# Altium project GRIPPER2009.PrjPcb (part 2 of 2)
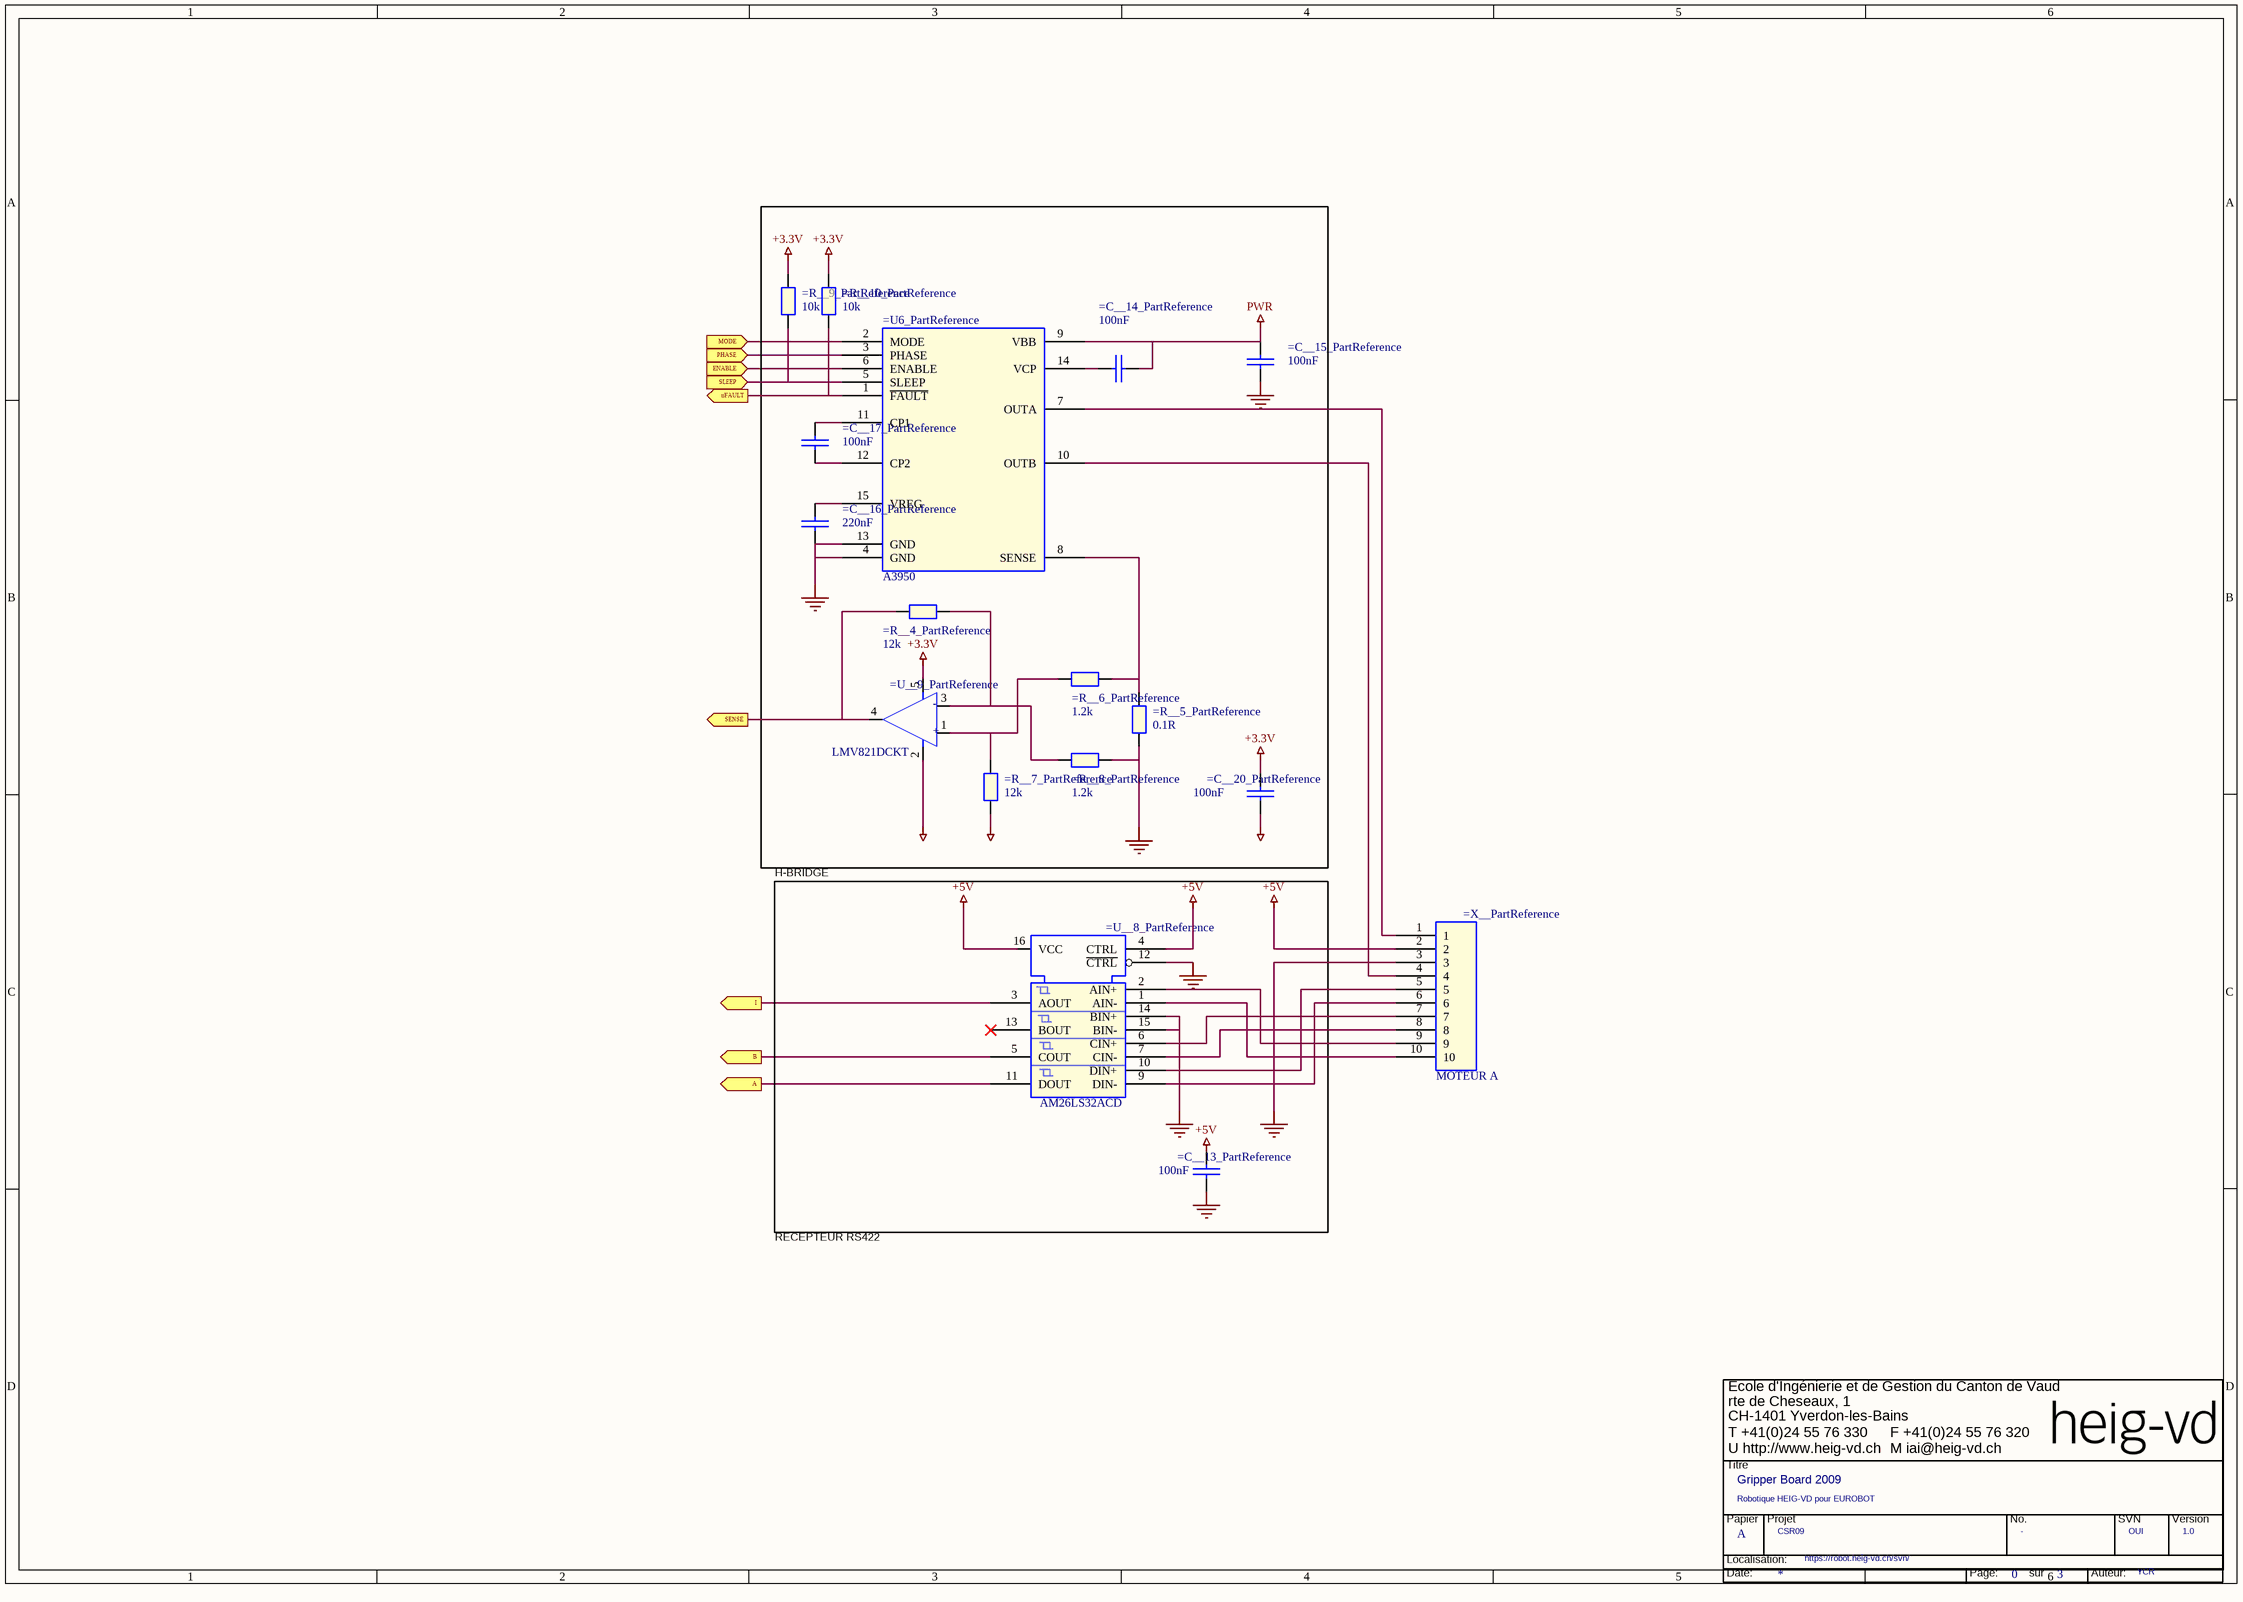
[diagram p7: 4.SchDoc]

## Nets that join several sheets
+1.8V: 2 (C10.1 C11.1 L5.2 R6.2), TWO MOTORS (14 pins), TWO MOTORS1 (14 pins)
+3.3V: 2 (C5.1 IC1.4 L3.2 R2.2), 3 (13 pins), TWO MOTORS (25 pins), TWO MOTORS/DRIVE1 (=C__20_PartReference_TWO_MOTORS_DRIVE1.1 =R__9_PartReference_TWO_MOTORS_DRIVE1.2 =R__10_PartReference_TWO_MOTORS_DRIVE1.2 =U__9_PartReference_TWO_MOTORS_DRIVE1.5), TWO MOTORS/DRIVE (=C__20_PartReference_TWO_MOTORS_DRIVE.1 =R__9_PartReference_TWO_MOTORS_DRIVE.2 =R__10_PartReference_TWO_MOTORS_DRIVE.2 =U__9_PartReference_TWO_MOTORS_DRIVE.5), TWO MOTORS1 (25 pins), TWO MOTORS1/DRIVE1 (=C__20_PartReference_TWO_MOTORS1_DRIVE1.1 =R__9_PartReference_TWO_MOTORS1_DRIVE1.2 =R__10_PartReference_TWO_MOTORS1_DRIVE1.2 =U__9_PartReference_TWO_MOTORS1_DRIVE1.5), TWO MOTORS1/DRIVE (=C__20_PartReference_TWO_MOTORS1_DRIVE.1 =R__9_PartReference_TWO_MOTORS1_DRIVE.2 =R__10_PartReference_TWO_MOTORS1_DRIVE.2 =U__9_PartReference_TWO_MOTORS1_DRIVE.5)
+5V: 2 (7 pins), 3 (7 pins), TWO MOTORS (=X29_PartReference_TWO_MOTORS.1 =X29_PartReference_TWO_MOTORS.2), TWO MOTORS/DRIVE1 (=C__13_PartReference_TWO_MOTORS_DRIVE1.1 =U__8_PartReference_TWO_MOTORS_DRIVE1.4 =U__8_PartReference_TWO_MOTORS_DRIVE1.16 =X__PartReference_TWO_MOTORS_DRIVE1.2), TWO MOTORS/DRIVE (=C__13_PartReference_TWO_MOTORS_DRIVE.1 =U__8_PartReference_TWO_MOTORS_DRIVE.4 =U__8_PartReference_TWO_MOTORS_DRIVE.16 =X__PartReference_TWO_MOTORS_DRIVE.2), TWO MOTORS1 (=X29_PartReference_TWO_MOTORS1.1 =X29_PartReference_TWO_MOTORS1.2), TWO MOTORS1/DRIVE1 (=C__13_PartReference_TWO_MOTORS1_DRIVE1.1 =U__8_PartReference_TWO_MOTORS1_DRIVE1.4 =U__8_PartReference_TWO_MOTORS1_DRIVE1.16 =X__PartReference_TWO_MOTORS1_DRIVE1.2), TWO MOTORS1/DRIVE (=C__13_PartReference_TWO_MOTORS1_DRIVE.1 =U__8_PartReference_TWO_MOTORS1_DRIVE.4 =U__8_PartReference_TWO_MOTORS1_DRIVE.16 =X__PartReference_TWO_MOTORS1_DRIVE.2)
+12V: 2 (L2.2), 3 (9 pins)
AGND: 2 (R150.2), TWO MOTORS (16 pins), TWO MOTORS/DRIVE1 (=C__20_PartReference_TWO_MOTORS_DRIVE1.2 =R__7_PartReference_TWO_MOTORS_DRIVE1.1 =U__9_PartReference_TWO_MOTORS_DRIVE1.2), TWO MOTORS/DRIVE (=C__20_PartReference_TWO_MOTORS_DRIVE.2 =R__7_PartReference_TWO_MOTORS_DRIVE.1 =U__9_PartReference_TWO_MOTORS_DRIVE.2), TWO MOTORS1 (16 pins), TWO MOTORS1/DRIVE1 (=C__20_PartReference_TWO_MOTORS1_DRIVE1.2 =R__7_PartReference_TWO_MOTORS1_DRIVE1.1 =U__9_PartReference_TWO_MOTORS1_DRIVE1.2), TWO MOTORS1/DRIVE (=C__20_PartReference_TWO_MOTORS1_DRIVE.2 =R__7_PartReference_TWO_MOTORS1_DRIVE.1 =U__9_PartReference_TWO_MOTORS1_DRIVE.2)
GND: 2 (20 pins), 3 (35 pins), TWO MOTORS (33 pins), TWO MOTORS/DRIVE1 (12 pins), TWO MOTORS/DRIVE (12 pins), TWO MOTORS1 (33 pins), TWO MOTORS1/DRIVE1 (12 pins), TWO MOTORS1/DRIVE (12 pins)
PGND: 2 (R8.1), 3 (18 pins), TWO MOTORS (6 pins), TWO MOTORS1 (6 pins)
PWR: 2 (L1.2), 3 (R21.2 X3.1), TWO MOTORS/DRIVE1 (=C__14_PartReference_TWO_MOTORS_DRIVE1.1 =C__15_PartReference_TWO_MOTORS_DRIVE1.1 =U6_PartReference_TWO_MOTORS_DRIVE1.9), TWO MOTORS/DRIVE (=C__14_PartReference_TWO_MOTORS_DRIVE.1 =C__15_PartReference_TWO_MOTORS_DRIVE.1 =U6_PartReference_TWO_MOTORS_DRIVE.9), TWO MOTORS1/DRIVE1 (=C__14_PartReference_TWO_MOTORS1_DRIVE1.1 =C__15_PartReference_TWO_MOTORS1_DRIVE1.1 =U6_PartReference_TWO_MOTORS1_DRIVE1.9), TWO MOTORS1/DRIVE (=C__14_PartReference_TWO_MOTORS1_DRIVE.1 =C__15_PartReference_TWO_MOTORS1_DRIVE.1 =U6_PartReference_TWO_MOTORS1_DRIVE.9)
Net=R__1_PartReference_TWO_MOTORS1_1: TWO MOTORS1 (=R__1_PartReference_TWO_MOTORS1.1), TWO MOTORS1/DRIVE (=R__4_PartReference_TWO_MOTORS1_DRIVE.2 =U__9_PartReference_TWO_MOTORS1_DRIVE.4)
Net=R__1_PartReference_TWO_MOTORS_1: TWO MOTORS (=R__1_PartReference_TWO_MOTORS.1), TWO MOTORS/DRIVE (=R__4_PartReference_TWO_MOTORS_DRIVE.2 =U__9_PartReference_TWO_MOTORS_DRIVE.4)
Net=R__4_PartReference_TWO_MOTORS1_DRIVE1_2: TWO MOTORS1 (=R__11_PartReference_TWO_MOTORS1.1), TWO MOTORS1/DRIVE1 (=R__4_PartReference_TWO_MOTORS1_DRIVE1.2 =U__9_PartReference_TWO_MOTORS1_DRIVE1.4)
Net=R__4_PartReference_TWO_MOTORS_DRIVE1_2: TWO MOTORS (=R__11_PartReference_TWO_MOTORS.1), TWO MOTORS/DRIVE1 (=R__4_PartReference_TWO_MOTORS_DRIVE1.2 =U__9_PartReference_TWO_MOTORS_DRIVE1.4)
Net=R__9_PartReference_TWO_MOTORS1_DRIVE1_1: TWO MOTORS1 (=U__PartReference_TWO_MOTORS1.53), TWO MOTORS1/DRIVE1 (=R__9_PartReference_TWO_MOTORS1_DRIVE1.1 =U6_PartReference_TWO_MOTORS1_DRIVE1.5)
Net=R__9_PartReference_TWO_MOTORS1_DRIVE_1: TWO MOTORS1 (=U__PartReference_TWO_MOTORS1.64), TWO MOTORS1/DRIVE (=R__9_PartReference_TWO_MOTORS1_DRIVE.1 =U6_PartReference_TWO_MOTORS1_DRIVE.5)
Net=R__9_PartReference_TWO_MOTORS_DRIVE1_1: TWO MOTORS (=U__PartReference_TWO_MOTORS.53), TWO MOTORS/DRIVE1 (=R__9_PartReference_TWO_MOTORS_DRIVE1.1 =U6_PartReference_TWO_MOTORS_DRIVE1.5)
Net=R__9_PartReference_TWO_MOTORS_DRIVE_1: TWO MOTORS (=U__PartReference_TWO_MOTORS.64), TWO MOTORS/DRIVE (=R__9_PartReference_TWO_MOTORS_DRIVE.1 =U6_PartReference_TWO_MOTORS_DRIVE.5)
Net=R__10_PartReference_TWO_MOTORS1_DRIVE1_1: TWO MOTORS1 (=U__PartReference_TWO_MOTORS1.60), TWO MOTORS1/DRIVE1 (=R__10_PartReference_TWO_MOTORS1_DRIVE1.1 =U6_PartReference_TWO_MOTORS1_DRIVE1.1)
Net=R__10_PartReference_TWO_MOTORS1_DRIVE_1: TWO MOTORS1 (=U__PartReference_TWO_MOTORS1.58), TWO MOTORS1/DRIVE (=R__10_PartReference_TWO_MOTORS1_DRIVE.1 =U6_PartReference_TWO_MOTORS1_DRIVE.1)
Net=R__10_PartReference_TWO_MOTORS_DRIVE1_1: TWO MOTORS (=U__PartReference_TWO_MOTORS.60), TWO MOTORS/DRIVE1 (=R__10_PartReference_TWO_MOTORS_DRIVE1.1 =U6_PartReference_TWO_MOTORS_DRIVE1.1)
Net=R__10_PartReference_TWO_MOTORS_DRIVE_1: TWO MOTORS (=U__PartReference_TWO_MOTORS.58), TWO MOTORS/DRIVE (=R__10_PartReference_TWO_MOTORS_DRIVE.1 =U6_PartReference_TWO_MOTORS_DRIVE.1)
Net=U6_PartReference_TWO_MOTORS1_DRIVE1_2: TWO MOTORS1 (=U__PartReference_TWO_MOTORS1.48), TWO MOTORS1/DRIVE1 (=U6_PartReference_TWO_MOTORS1_DRIVE1.2)
Net=U6_PartReference_TWO_MOTORS1_DRIVE1_3: TWO MOTORS1 (=U__PartReference_TWO_MOTORS1.51), TWO MOTORS1/DRIVE1 (=U6_PartReference_TWO_MOTORS1_DRIVE1.3)
Net=U6_PartReference_TWO_MOTORS1_DRIVE1_6: TWO MOTORS1 (=U__PartReference_TWO_MOTORS1.45), TWO MOTORS1/DRIVE1 (=U6_PartReference_TWO_MOTORS1_DRIVE1.6)
Net=U6_PartReference_TWO_MOTORS1_DRIVE_2: TWO MOTORS1 (=U__PartReference_TWO_MOTORS1.44), TWO MOTORS1/DRIVE (=U6_PartReference_TWO_MOTORS1_DRIVE.2)
Net=U6_PartReference_TWO_MOTORS1_DRIVE_3: TWO MOTORS1 (=U__PartReference_TWO_MOTORS1.61), TWO MOTORS1/DRIVE (=U6_PartReference_TWO_MOTORS1_DRIVE.3)
Net=U6_PartReference_TWO_MOTORS1_DRIVE_6: TWO MOTORS1 (=U__PartReference_TWO_MOTORS1.47), TWO MOTORS1/DRIVE (=U6_PartReference_TWO_MOTORS1_DRIVE.6)
Net=U6_PartReference_TWO_MOTORS_DRIVE1_2: TWO MOTORS (=U__PartReference_TWO_MOTORS.48), TWO MOTORS/DRIVE1 (=U6_PartReference_TWO_MOTORS_DRIVE1.2)
Net=U6_PartReference_TWO_MOTORS_DRIVE1_3: TWO MOTORS (=U__PartReference_TWO_MOTORS.51), TWO MOTORS/DRIVE1 (=U6_PartReference_TWO_MOTORS_DRIVE1.3)
Net=U6_PartReference_TWO_MOTORS_DRIVE1_6: TWO MOTORS (=U__PartReference_TWO_MOTORS.45), TWO MOTORS/DRIVE1 (=U6_PartReference_TWO_MOTORS_DRIVE1.6)
Net=U6_PartReference_TWO_MOTORS_DRIVE_2: TWO MOTORS (=U__PartReference_TWO_MOTORS.44), TWO MOTORS/DRIVE (=U6_PartReference_TWO_MOTORS_DRIVE.2)
Net=U6_PartReference_TWO_MOTORS_DRIVE_3: TWO MOTORS (=U__PartReference_TWO_MOTORS.61), TWO MOTORS/DRIVE (=U6_PartReference_TWO_MOTORS_DRIVE.3)
Net=U6_PartReference_TWO_MOTORS_DRIVE_6: TWO MOTORS (=U__PartReference_TWO_MOTORS.47), TWO MOTORS/DRIVE (=U6_PartReference_TWO_MOTORS_DRIVE.6)
Net=U__1_PartReference_TWO_MOTORS1_1: TWO MOTORS1 (=U__1_PartReference_TWO_MOTORS1.1), TWO MOTORS1/DRIVE1 (=U__8_PartReference_TWO_MOTORS1_DRIVE1.11)
Net=U__1_PartReference_TWO_MOTORS_1: TWO MOTORS (=U__1_PartReference_TWO_MOTORS.1), TWO MOTORS/DRIVE1 (=U__8_PartReference_TWO_MOTORS_DRIVE1.11)
Net=U__3_PartReference_TWO_MOTORS1_1: TWO MOTORS1 (=U__3_PartReference_TWO_MOTORS1.1), TWO MOTORS1/DRIVE1 (=U__8_PartReference_TWO_MOTORS1_DRIVE1.5)
Net=U__3_PartReference_TWO_MOTORS_1: TWO MOTORS (=U__3_PartReference_TWO_MOTORS.1), TWO MOTORS/DRIVE1 (=U__8_PartReference_TWO_MOTORS_DRIVE1.5)
Net=U__4_PartReference_TWO_MOTORS1_1: TWO MOTORS1 (=U__4_PartReference_TWO_MOTORS1.1), TWO MOTORS1/DRIVE (=U__8_PartReference_TWO_MOTORS1_DRIVE.11)
Net=U__4_PartReference_TWO_MOTORS_1: TWO MOTORS (=U__4_PartReference_TWO_MOTORS.1), TWO MOTORS/DRIVE (=U__8_PartReference_TWO_MOTORS_DRIVE.11)
Net=U__5_PartReference_TWO_MOTORS1_1: TWO MOTORS1 (=U__5_PartReference_TWO_MOTORS1.1), TWO MOTORS1/DRIVE (=U__8_PartReference_TWO_MOTORS1_DRIVE.5)
Net=U__5_PartReference_TWO_MOTORS_1: TWO MOTORS (=U__5_PartReference_TWO_MOTORS.1), TWO MOTORS/DRIVE (=U__8_PartReference_TWO_MOTORS_DRIVE.5)
Net=U__6_PartReference_TWO_MOTORS1_1: TWO MOTORS1 (=U__6_PartReference_TWO_MOTORS1.1), TWO MOTORS1/DRIVE1 (=U__8_PartReference_TWO_MOTORS1_DRIVE1.3)
Net=U__6_PartReference_TWO_MOTORS_1: TWO MOTORS (=U__6_PartReference_TWO_MOTORS.1), TWO MOTORS/DRIVE1 (=U__8_PartReference_TWO_MOTORS_DRIVE1.3)
Net=U__7_PartReference_TWO_MOTORS1_1: TWO MOTORS1 (=U__7_PartReference_TWO_MOTORS1.1), TWO MOTORS1/DRIVE (=U__8_PartReference_TWO_MOTORS1_DRIVE.3)
Net=U__7_PartReference_TWO_MOTORS_1: TWO MOTORS (=U__7_PartReference_TWO_MOTORS.1), TWO MOTORS/DRIVE (=U__8_PartReference_TWO_MOTORS_DRIVE.3)
Net=U__PartReference_TWO_MOTORS1_57: 3 (U1.18), TWO MOTORS1 (=U__PartReference_TWO_MOTORS1.57)
Net=U__PartReference_TWO_MOTORS1_76: 3 (X7.7), TWO MOTORS1 (=U__PartReference_TWO_MOTORS1.76)
Net=U__PartReference_TWO_MOTORS1_90: 3 (R19.2), TWO MOTORS1 (=U__PartReference_TWO_MOTORS1.90)
Net=U__PartReference_TWO_MOTORS_5: TWO MOTORS (=U__PartReference_TWO_MOTORS.5), TWO MOTORS1 (=U__PartReference_TWO_MOTORS1.100)
Net=U__PartReference_TWO_MOTORS_50: 3 (U1.19), TWO MOTORS (=U__PartReference_TWO_MOTORS.50), TWO MOTORS1 (=U__PartReference_TWO_MOTORS1.50)
Net=U__PartReference_TWO_MOTORS_52: 3 (U1.20), TWO MOTORS (=U__PartReference_TWO_MOTORS.52), TWO MOTORS1 (=U__PartReference_TWO_MOTORS1.52)
Net=U__PartReference_TWO_MOTORS_54: 3 (U1.1), TWO MOTORS (=U__PartReference_TWO_MOTORS.54), TWO MOTORS1 (=U__PartReference_TWO_MOTORS1.54)
Net=U__PartReference_TWO_MOTORS_57: 3 (U1.7), TWO MOTORS (=U__PartReference_TWO_MOTORS.57)
Net=U__PartReference_TWO_MOTORS_73: 3 (X7.3), TWO MOTORS (=U__PartReference_TWO_MOTORS.73)
Net=U__PartReference_TWO_MOTORS_74: 3 (X7.1), TWO MOTORS (=U__PartReference_TWO_MOTORS.74), TWO MOTORS1 (=U__PartReference_TWO_MOTORS1.74)
Net=U__PartReference_TWO_MOTORS_75: 3 (X7.9 X7.11), TWO MOTORS (=U__PartReference_TWO_MOTORS.75), TWO MOTORS1 (=U__PartReference_TWO_MOTORS1.75)
Net=U__PartReference_TWO_MOTORS_76: TWO MOTORS (=U__PartReference_TWO_MOTORS.76), TWO MOTORS1 (=U__PartReference_TWO_MOTORS1.73)
Net=U__PartReference_TWO_MOTORS_78: 3 (R16.1), TWO MOTORS (=U__PartReference_TWO_MOTORS.78), TWO MOTORS1 (=U__PartReference_TWO_MOTORS1.78)
Net=U__PartReference_TWO_MOTORS_80: 3 (X7.13), TWO MOTORS (=U__PartReference_TWO_MOTORS.80), TWO MOTORS1 (=U__PartReference_TWO_MOTORS1.80)
Net=U__PartReference_TWO_MOTORS_81: 3 (X7.14), TWO MOTORS (=U__PartReference_TWO_MOTORS.81), TWO MOTORS1 (=U__PartReference_TWO_MOTORS1.81)
Net=U__PartReference_TWO_MOTORS_84: 3 (X7.2), TWO MOTORS (=U__PartReference_TWO_MOTORS.84), TWO MOTORS1 (=U__PartReference_TWO_MOTORS1.84)
Net=U__PartReference_TWO_MOTORS_90: 3 (R17.2), TWO MOTORS (=U__PartReference_TWO_MOTORS.90)